# EAGLE design hihats (EAGLE 6.4)
DATABASE: ../partsdb.txt

## Sheet 1 of 2
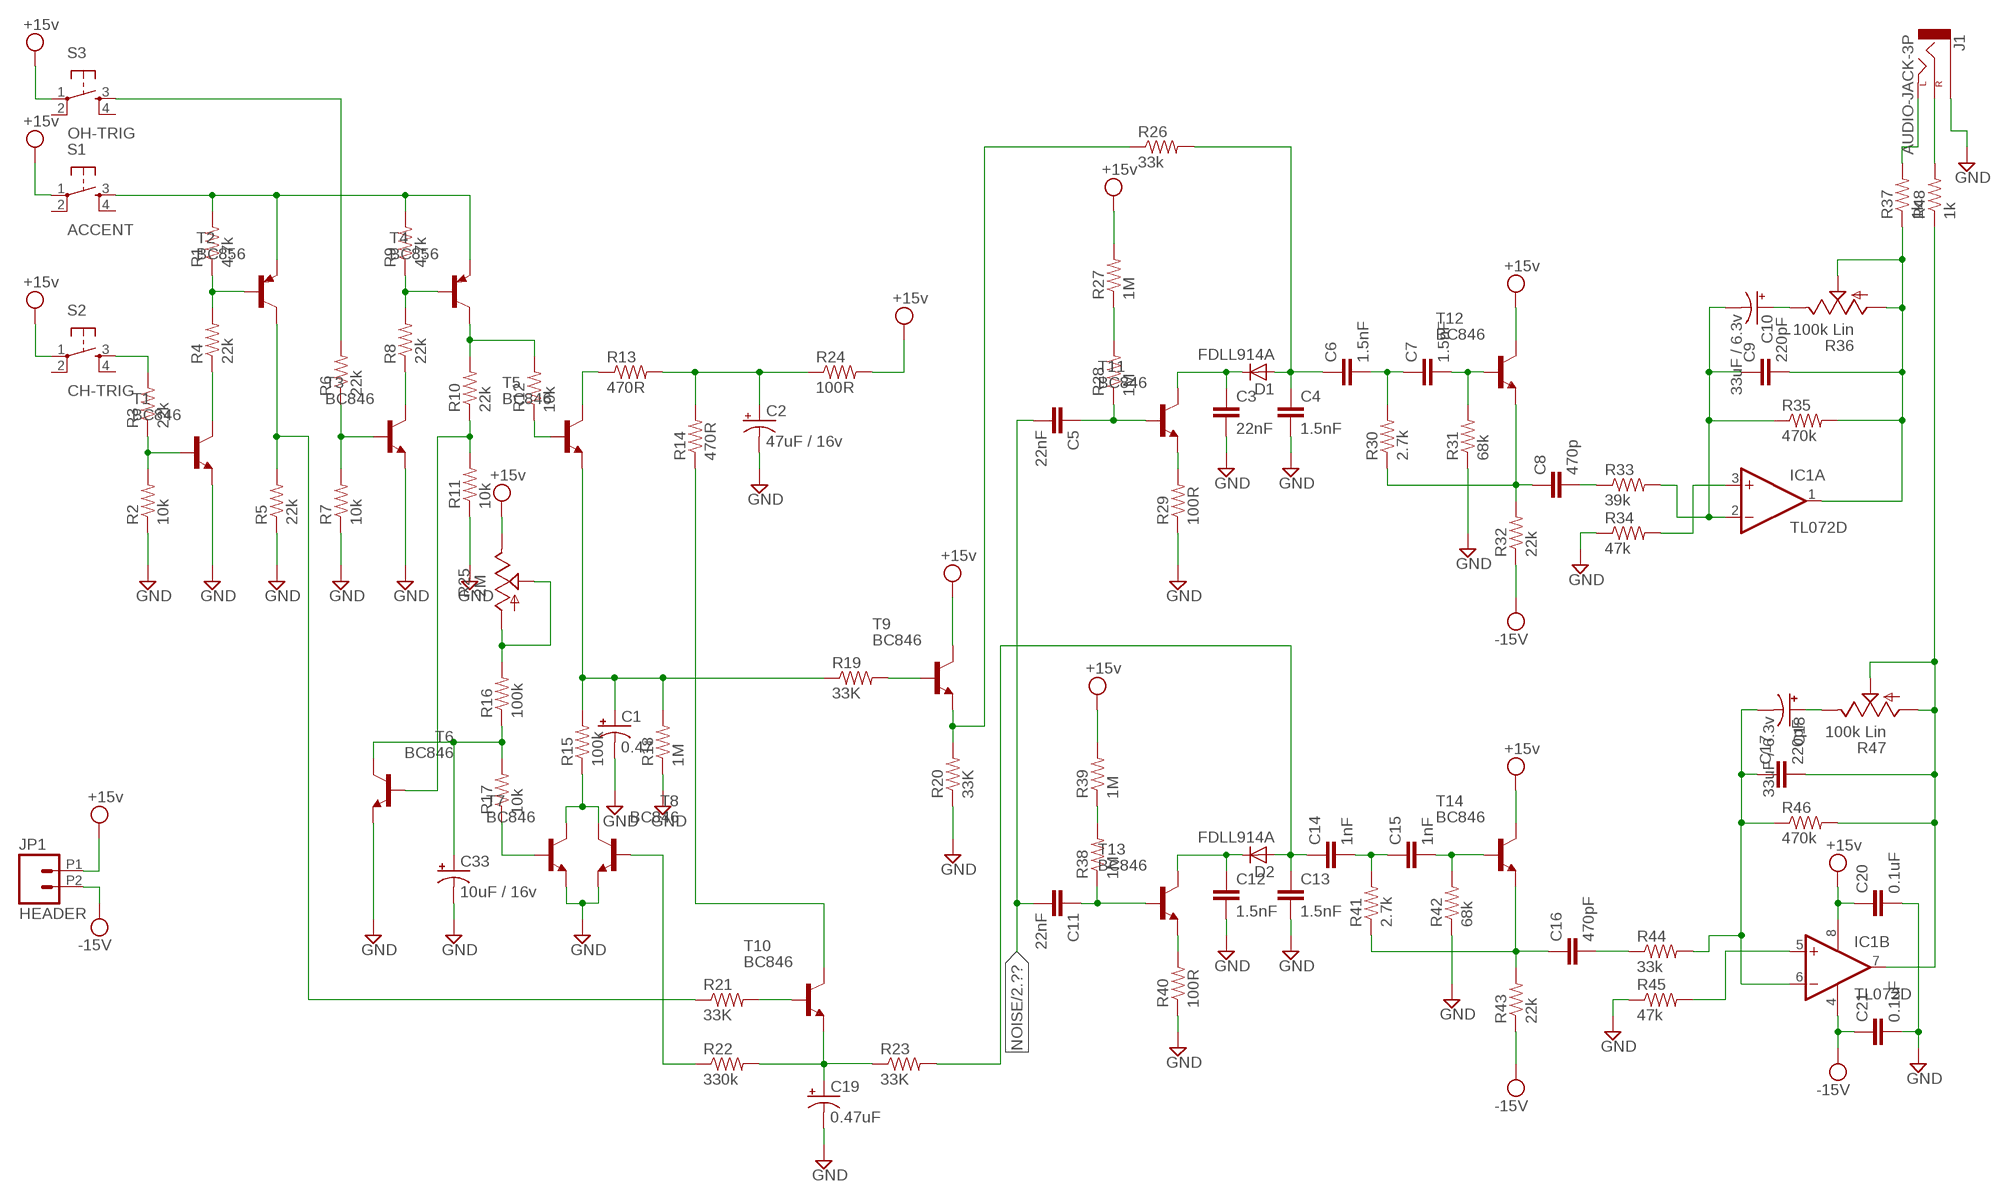
[diagram p0: schematic, sheet 1]

### Parts
C1  0.47  CAP-POLPANASONIC_B-2  [PANASONIC_VS_B-2]
C2  47uF / 16v  CAP-POLPANASONIC_B-2  [PANASONIC_VS_B-2]
C3  22nF  CAP0805  [0805]
C4  1.5nF  CAP0805  [0805]
C5  22nF  CAP0805  [0805]
C6  1.5nF  CAP0805  [0805]
C7  1.5nF  CAP0805  [0805]
C8  470p  CAP0805  [0805]
C9  220pF  CAP0805  [0805]
C10  33uF / 6.3v  CAP-POLPANASONIC_B-2  [PANASONIC_VS_B-2]
C11  22nF  CAP0805  [0805]
C12  1.5nF  CAP0805  [0805]
C13  1.5nF  CAP0805  [0805]
C14  1nF  CAP0805  [0805]
C15  1nF  CAP0805  [0805]
C16  470pF  CAP0805  [0805]
C17  220pF  CAP0805  [0805]
C18  33uF / 6.3v  CAP-POLPANASONIC_B-2  [PANASONIC_VS_B-2]
C19  0.47uF  CAP-POLPANASONIC_B-2  [PANASONIC_VS_B-2]
C20  0.1uF  CAP0805  [0805]
C21  0.1uF  CAP0805  [0805]
C33  10uF / 16v  CAP-POLPANASONIC_B-2  [PANASONIC_VS_B-2]
D1  FDLL914A  D-MLL-34  [MELF-MLL34]
D2  FDLL914A  D-MLL-34  [MELF-MLL34]
IC1  TL072D  [SO08]
J1  AUDIO-JACK-3P  [CUI-352X-SMT]
JP1  HEADER  [1X02-5.08-SCREWTERM]
R1  4.7k  RESISTOR0805-RES  [0805]
R2  10k  RESISTOR0805-RES  [0805]
R3  22k  RESISTOR0805-RES  [0805]
R4  22k  RESISTOR0805-RES  [0805]
R5  22k  RESISTOR0805-RES  [0805]
R6  22k  RESISTOR0805-RES  [0805]
R7  10k  RESISTOR0805-RES  [0805]
R8  22k  RESISTOR0805-RES  [0805]
R9  4.7k  RESISTOR0805-RES  [0805]
R10  22k  RESISTOR0805-RES  [0805]
R11  10k  RESISTOR0805-RES  [0805]
R12  10k  RESISTOR0805-RES  [0805]
R13  470R  RESISTOR0805-RES  [0805]
R14  470R  RESISTOR0805-RES  [0805]
R15  100k  RESISTOR0805-RES  [0805]
R16  100k  RESISTOR0805-RES  [0805]
R17  10k  RESISTOR0805-RES  [0805]
R18  1M  RESISTOR0805-RES  [0805]
R19  33K  RESISTOR0805-RES  [0805]
R20  33K  RESISTOR0805-RES  [0805]
R21  33K  RESISTOR0805-RES  [0805]
R22  330k  RESISTOR0805-RES  [0805]
R23  33K  RESISTOR0805-RES  [0805]
R24  100R  RESISTOR0805-RES  [0805]
R25  2M  POTTHUMB-3352  [POTENTIOMETER-3352P]
R26  33k  RESISTOR0805-RES  [0805]
R27  1M  RESISTOR0805-RES  [0805]
R28  1M  RESISTOR0805-RES  [0805]
R29  100R  RESISTOR0805-RES  [0805]
R30  2.7k  RESISTOR0805-RES  [0805]
R31  68k  RESISTOR0805-RES  [0805]
R32  22k  RESISTOR0805-RES  [0805]
R33  39k  RESISTOR0805-RES  [0805]
R34  47k  RESISTOR0805-RES  [0805]
R35  470k  RESISTOR0805-RES  [0805]
R36  100k Lin  POTCTS296  [POTENTIOMETER-CTS296]
R37  1k  RESISTOR0805-RES  [0805]
R38  1M  RESISTOR0805-RES  [0805]
R39  1M  RESISTOR0805-RES  [0805]
R40  100R  RESISTOR0805-RES  [0805]
R41  2.7k  RESISTOR0805-RES  [0805]
R42  68k  RESISTOR0805-RES  [0805]
R43  22k  RESISTOR0805-RES  [0805]
R44  33k  RESISTOR0805-RES  [0805]
R45  47k  RESISTOR0805-RES  [0805]
R46  470k  RESISTOR0805-RES  [0805]
R47  100k Lin  POTCTS296  [POTENTIOMETER-CTS296]
R48  1k  RESISTOR0805-RES  [0805]
S1  ACCENT  TAC_SWITCHSMD  [TACTILE_SWITCH_SMD]
S2  CH-TRIG  TAC_SWITCHSMD  [TACTILE_SWITCH_SMD]
S3  OH-TRIG  TAC_SWITCHSMD  [TACTILE_SWITCH_SMD]
T1  BC846  [SOT23]
T2  BC856  BC856B-PNP-SOT23-BEC  [SOT23-BEC]
T3  BC846  [SOT23]
T4  BC856  BC856B-PNP-SOT23-BEC  [SOT23-BEC]
T5  BC846  [SOT23]
T6  BC846  [SOT23]
T7  BC846  [SOT23]
T8  BC846  [SOT23]
T9  BC846  [SOT23]
T10  BC846  [SOT23]
T11  BC846  [SOT23]
T12  BC846  [SOT23]
T13  BC846  [SOT23]
T14  BC846  [SOT23]

### Nets
+15V: C20.1 IC1.8(P:V+) JP1.P1 R24.2 R25.P$3(E) R27.2 R39.2 S1.1 S2.1 S3.1 T9.3(C) T12.3(C) T14.3(C) ; supply symbol labelled +15v ; also sheet 2
-15V: C21.1 IC1.4(P:V-) JP1.P2 R32.1 R43.1 ; also sheet 2
GND: C1.- C2.- C3.2 C4.2 C12.2 C13.2 C19.- C20.2 C21.2 C33.- J1.1(SLEEVE) R2.1 R5.1 R7.1 R11.1 R18.1 R20.1 R29.1 R31.1 R34.1 R40.1 R42.1 R45.1 T1.2(E) T3.2(E) T6.2(E) T7.2(E) T8.2(E) ; also sheet 2
N$1: R1.2 R9.2 S1.3 T2.E T4.E
N$2: R1.1 R4.2 T2.B
N$3: R3.2 S2.3
N$4: R2.2 R3.1 T1.1(B)
N$5: R4.1 T1.3(C)
N$6: R8.2 R9.1 T4.B
N$7: R5.2 R21.1 T2.C
N$8: R6.2 S3.3
N$9: R6.1 R7.2 T3.1(B)
N$10: R8.1 T3.3(C)
N$11: R10.2 R12.2 T4.C
N$12: R10.1 R11.2 T6.1(B)
N$13: R12.1 T5.1(B)
N$14: R13.1 T5.3(C)
N$15: C2.+ R13.2 R14.2 R24.1
N$16: R15.1 T7.3(C) T8.3(C)
N$17: C33.+ R16.1 R17.2 T6.3(C)
N$18: R19.2 T9.1(B)
N$19: R17.1 T7.1(B)
N$20: R20.2 R26.1 T9.2(E)
N$21: R21.2 T10.1(B)
N$22: C1.+ R15.2 R18.2 R19.1 T5.2(E)
N$23: R22.1 T8.1(B)
N$24: C19.+ R22.2 R23.1 T10.2(E)
N$25: R14.1 T10.3(C)
N$26: C4.1 C6.1 D1.2(A) R26.2
N$27: R16.2 R25.P$1(A) R25.P$2(S)
N$28: R27.1 R28.2
N$29: C5.1 R28.1 T11.1(B)
N$31: R29.2 T11.2(E)
N$32: C3.1 D1.1(C) T11.3(C)
N$33: C6.2 C7.1 R30.2
N$34: C7.2 R31.2 T12.1(B)
N$35: C8.1 R30.1 R32.2 T12.2(E)
N$36: C8.2 R33.1
N$37: C9.1 C10.- IC1.2(A:-IN) R33.2 R35.1
N$38: IC1.3(A:+IN) R34.2
N$39: C9.2 IC1.1(A:OUT) R35.2 R36.P$1(A) R36.P$2(S) R37.1
N$40: R40.2 T13.2(E)
N$41: C10.+ R36.P$3(E)
N$42: C12.1 D2.1(C) T13.3(C)
N$43: R38.2 R39.1
N$44: C11.1 R38.1 T13.1(B)
N$45: C13.1 C14.1 D2.2(A) R23.2
N$46: C14.2 C15.1 R41.2
N$47: C15.2 R42.2 T14.1(B)
N$48: C16.1 R41.1 R43.2 T14.2(E)
N$49: C16.2 R44.1
N$50: C17.1 C18.- IC1.6(B:-IN) R44.2 R46.1
N$51: IC1.5(B:+IN) R45.2
N$52: J1.2(LEFT) R37.2
N$53: C17.2 IC1.7(B:OUT) R46.2 R47.P$1(A) R47.P$2(S) R48.1
N$54: C18.+ R47.P$3(E)
N$55: J1.3(RIGHT) R48.2
NOISE: C5.2 C11.2 ; also sheet 2
Unconnected: S1.2 S1.4 S2.2 S2.4 S3.2 S3.4

## Sheet 2 of 2
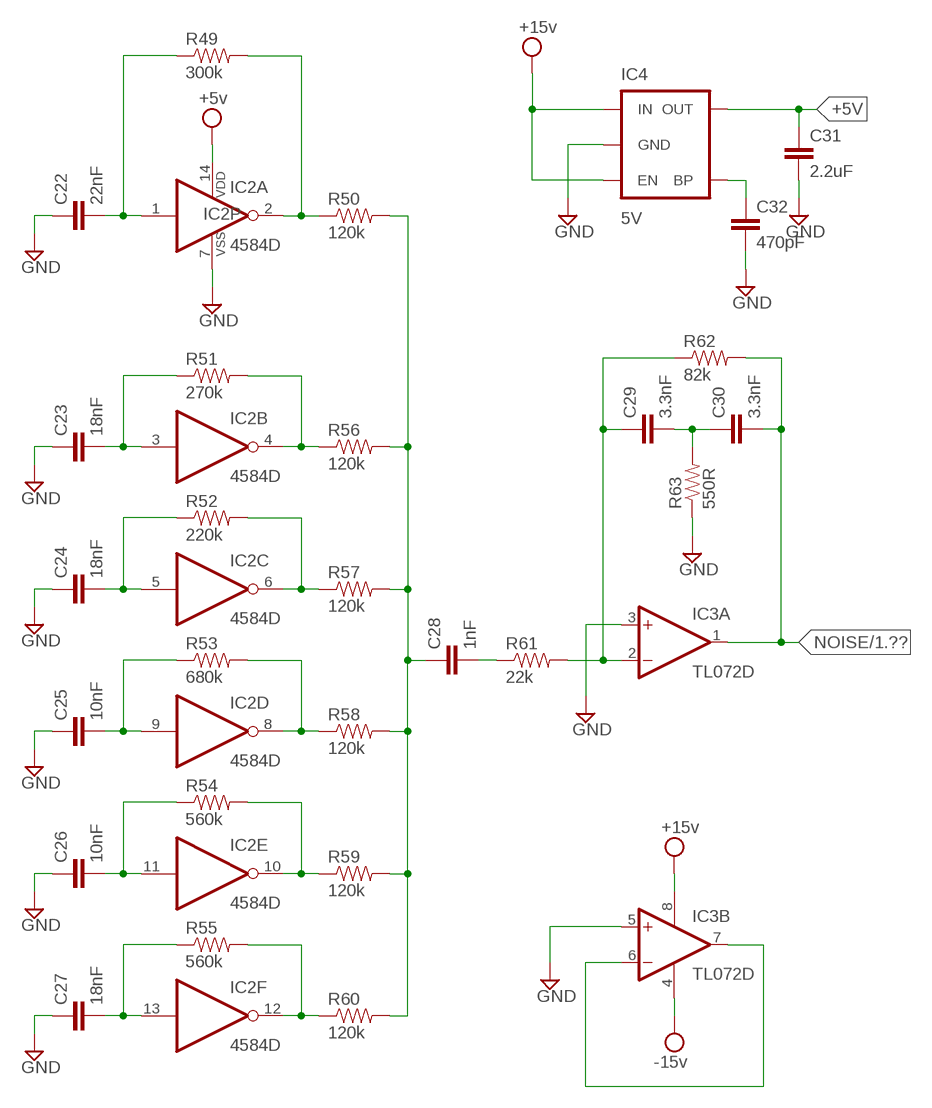
[diagram p1: schematic, sheet 2]

### Parts
C22  22nF  CAP0805  [0805]
C23  18nF  CAP0805  [0805]
C24  18nF  CAP0805  [0805]
C25  10nF  CAP0805  [0805]
C26  10nF  CAP0805  [0805]
C27  18nF  CAP0805  [0805]
C28  1nF  CAP0805  [0805]
C29  3.3nF  CAP0805  [0805]
C30  3.3nF  CAP0805  [0805]
C31  2.2uF  CAP0805  [0805]
C32  470pF  CAP0805  [0805]
IC2  4584D  [SO14]
IC3  TL072D  [SO08]
IC4  5V  V_REG_MIC52055V  [SOT23-5]
R49  300k  RESISTOR0805-RES  [0805]
R50  120k  RESISTOR0805-RES  [0805]
R51  270k  RESISTOR0805-RES  [0805]
R52  220k  RESISTOR0805-RES  [0805]
R53  680k  RESISTOR0805-RES  [0805]
R54  560k  RESISTOR0805-RES  [0805]
R55  560k  RESISTOR0805-RES  [0805]
R56  120k  RESISTOR0805-RES  [0805]
R57  120k  RESISTOR0805-RES  [0805]
R58  120k  RESISTOR0805-RES  [0805]
R59  120k  RESISTOR0805-RES  [0805]
R60  120k  RESISTOR0805-RES  [0805]
R61  22k  RESISTOR0805-RES  [0805]
R62  82k  RESISTOR0805-RES  [0805]
R63  550R  RESISTOR0805-RES  [0805]

### Nets
+5V: C31.1 IC2.14(P:VDD) IC4.5(OUT) ; supply symbol labelled +5v
+15V: IC3.8(P:V+) IC4.1(IN) IC4.3(EN) ; supply symbol labelled +15v ; also sheet 1
-15V: IC3.4(P:V-) ; supply symbol labelled -15v ; also sheet 1
GND: C22.1 C23.1 C24.1 C25.1 C26.1 C27.1 C31.2 C32.2 IC2.7(P:VSS) IC3.3(A:+IN) IC3.5(B:+IN) IC4.2(GND) R63.1 ; also sheet 1
N$56: IC2.2(A:O) R49.2 R50.1
N$57: C22.2 IC2.1(A:I) R49.1
N$58: C27.2 IC2.13(F:I) R55.1
N$59: C26.2 IC2.11(E:I) R54.1
N$60: C25.2 IC2.9(D:I) R53.1
N$61: C24.2 IC2.5(C:I) R52.1
N$62: C23.2 IC2.3(B:I) R51.1
N$63: IC2.4(B:O) R51.2 R56.1
N$64: IC2.6(C:O) R52.2 R57.1
N$65: IC2.8(D:O) R53.2 R58.1
N$66: IC2.10(E:O) R54.2 R59.1
N$67: IC2.12(F:O) R55.2 R60.1
N$68: C28.1 R50.2 R56.2 R57.2 R58.2 R59.2 R60.2
N$69: IC3.6(B:-IN) IC3.7(B:OUT)
N$70: C28.2 R61.1
N$71: C29.1 IC3.2(A:-IN) R61.2 R62.1
N$72: C29.2 C30.1 R63.2
N$74: C32.1 IC4.4(BP)
NOISE: C30.2 IC3.1(A:OUT) R62.2 ; also sheet 1

## Library data of the parts
C1 = Livestream:CAP-POL; PARTNO: EEE-1HAR47AR
C2 = Livestream:CAP-POL; PARTNO: EEE-1CA470WR
C3-C9 C11-C17 C20-C32 = SparkFun-Capacitors:CAP: Capacitor Standard 0603 ceramic capacitor, and 0.1" leaded capacitor.; PARTNO: C0805C682K5RACTU
C10 C18 = Livestream:CAP-POL; PARTNO: EEE-1AA330WAR
C19 = Livestream:CAP-POL; PARTNO: UWJ1HR47MCL1GB
C33 = Livestream:CAP-POL; PARTNO: EEE-1VA100WAR
D1 D2 = semicon-smd-ipc:D-: DIODE unfilled; PARTNO: FDLL914A
IC1 IC3 = linear:TL072: OP AMP; PARTNO: TL072SG-13
IC2 = 45xx:4584: Hex SCHMITT TRIGGER (74C14); PARTNO: BU4584BF-E2
IC4 = SparkFun-PowerIC:V_REG_MIC5205: V_REG MIC5219 Standard 3.3V and 5V 150mA LDO voltage regulator in SOT-23 layout. Micrel part MIC5205. BP (by-pass) pin is used to lower output noise with 470pF cap, may be left open.; PARTNO: MIC5205-5.0YM5 TR; PROD_ID: VREG-00823
J1 = Livestream:AUDIO-JACK-3P; PARTNO: SJ-3523-SMT-TR
JP1 = Livestream:HEADER
R1-R24 R26-R35 R37-R46 R48-R63 = SparkFun-Resistors:RESISTOR: Resistor Basic schematic elements and footprints for 0603, 1206, and PTH resistors.; PARTNO: RMCF0805FT10K0
R25 = 808:POT; PARTNO: 3352P-1-205LF
R36 R47 = 808:POT; PARTNO: 296UD104B1N
S1-S3 = SparkFun-Electromechanical:TAC_SWITCH: Momentary Switch Button commonly used for reset or general input. Spark Fun Electronics SKU : COM-00097 SMT- SWCH-08247; PARTNO: PTS525SM10SMTR LFS; PROD_ID: SWCH-08247
T1 T3 T5-T14 = transistor-neu-to92:BC846: NPN TRANSISTOR; PARTNO: BC846BMTF
T2 T4 = transistor-neu-to92:*-PNP-: PNP Transistror; PARTNO: BC856BMTF

## Board
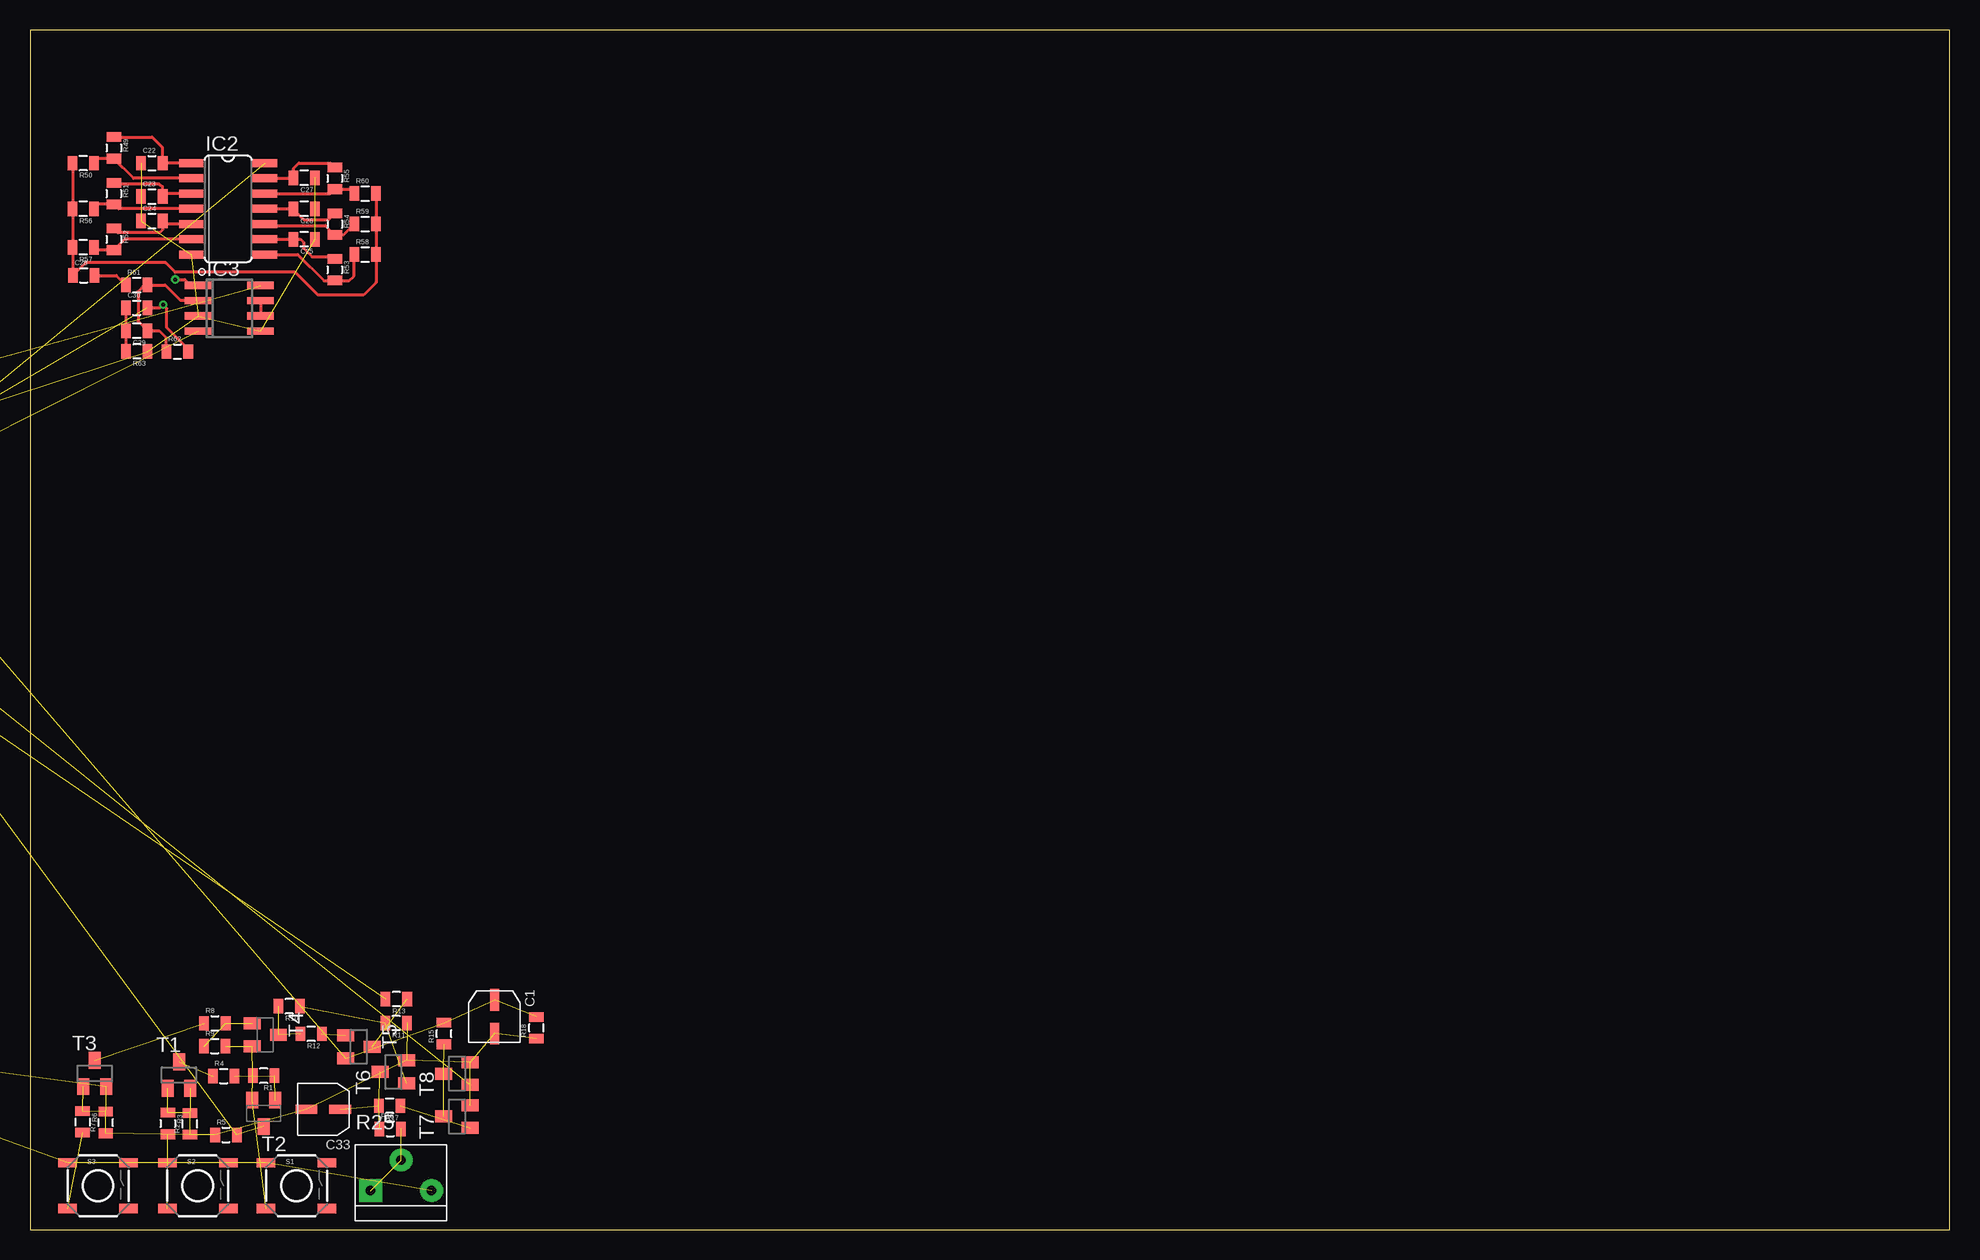
[diagram p2: board, top side]
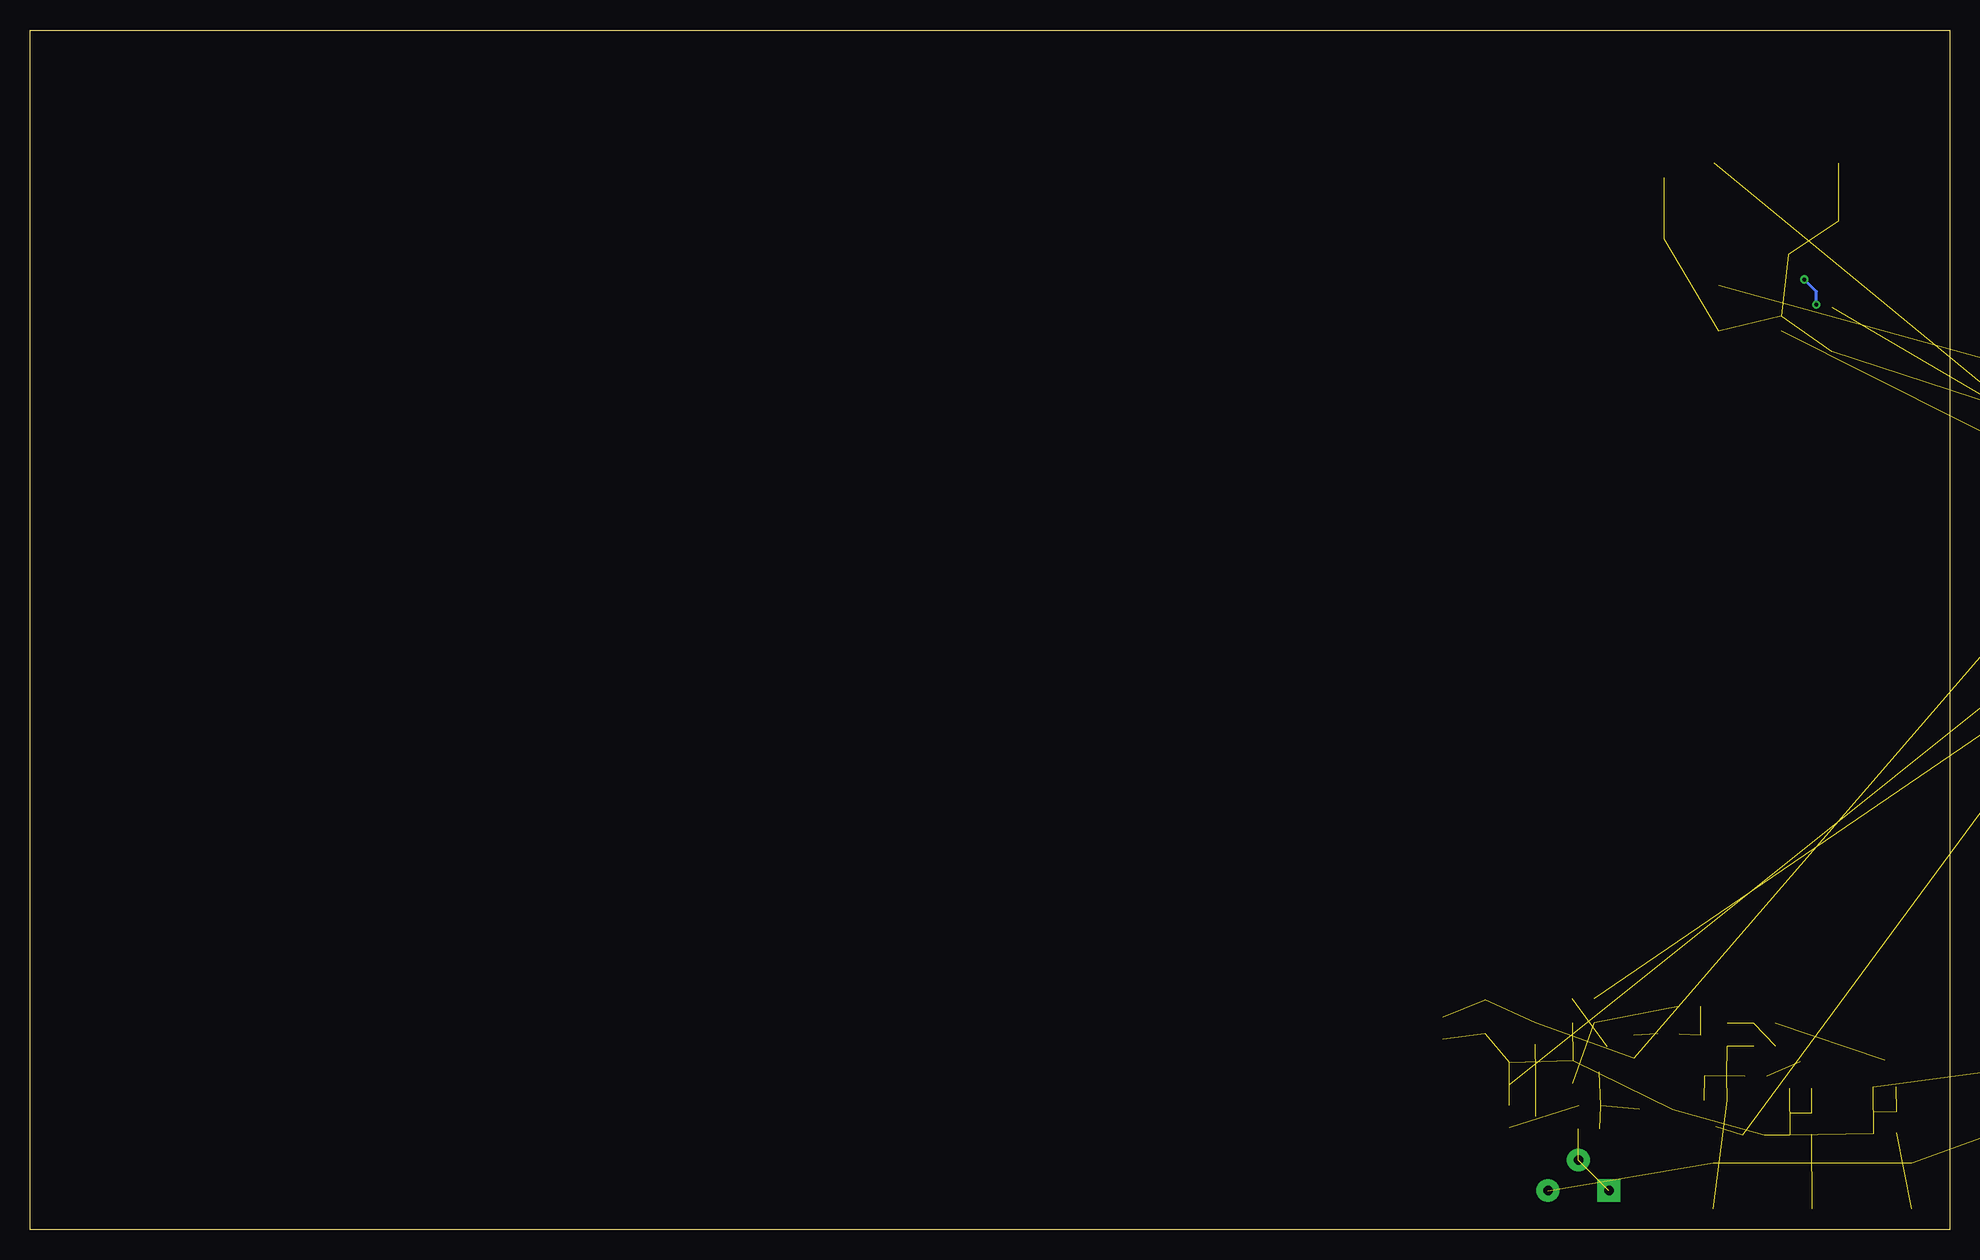
[diagram p3: board, bottom side, seen from below]

Size 160 x 100 mm. Coordinates in mm from the lower left corner, seen from the top.
Outline: 0,0 160,0 160,100 0,100 0,0
Copper layers (1*16): Top 0.0356mm / dielectric 1.5011mm / Bottom 0.0356mm
Design rules "OSHPark": minimum track width 6mil, minimum drill 13mil, track to track 6mil, track to pad 6mil, pad to pad 6mil, via to via 6mil, smd to smd 6mil, copper to edge 15mil, drill to drill 6mil, minimum pad ring 7mil, minimum via ring 7mil, stop-mask expansion 3mil, vias tented up to drill 0mil, thermal gap 10mil

### Footprints (pad centres in the part's own frame; a part is rotated, then mirrored left to right if it is on the bottom)
PANASONIC_VS_B-2 = smd 0.75 x 1.8: + 0,-1.4; - 0,1.4
0805 = smd 0.8 x 1.2: 1 -0.9,0; 2 0.9,0
MELF-MLL34 = smd 1.4 x 1.8: 1 -1.7,0; 2 1.7,0
SO08 = smd 0.6 x 2.2: 1 -1.905,-2.6; 2 -0.635,-2.6; 3 0.635,-2.6; 4 1.905,-2.6; 5 1.905,2.6; 6 0.635,2.6; 7 -0.635,2.6; 8 -1.905,2.6
SO14 = smd 0.66 x 2.032: 1 -3.81,-3.073; 2 -2.54,-3.073; 3 -1.27,-3.073; 4 0,-3.073; 5 1.27,-3.073; 6 2.54,-3.073; 7 3.81,-3.073; 8 3.81,3.073; 9 2.54,3.073; 10 1.27,3.073; 11 0,3.073; 12 -1.27,3.073; 13 -2.54,3.073; 14 -3.81,3.073
SOT23-5 = smd 0.55 x 1.2: 1 -0.95,-1.3; 2 0,-1.3; 3 0.95,-1.3; 4 0.95,1.3; 5 -0.95,1.3
CUI-352X-SMT = smd 2.2 x 2.8: 1 -4.6,-3.7 | smd 2.8 x 2.8: 2 4.8,-3.7; 4 8.7,0.75 | smd 2.2 x 2.5: 3 -2.6,3.2 | hole 1.7: -3.5,0; 3.5,0
1X02-5.08-SCREWTERM = drill 1.016 square: P1 -2.54,0; P2 2.54,0
POTENTIOMETER-3352P = drill 0.8 pad 1.905 square: P$1 0,0 | drill 0.8 pad 1.905: P$2 2.54,2.54; P$3 5.08,0
POTENTIOMETER-CTS296 = drill 1.3 pad 2.5 square: P$1 -3.75,-5 | drill 1.3 pad 2.5: P$2 0,-5; P$3 3.75,-5 | hole 1.6: -5.5,5; 5.5,5
TACTILE_SWITCH_SMD = smd 1.524 x 0.762: 1 -2.54,1.905; 2 2.54,1.905; 3 -2.54,-1.905; 4 2.54,-1.905
SOT23 = smd 1 x 1.4: 1 -0.95,-1.1; 2 0.95,-1.1; 3 0,1.1
SOT23-BEC = smd 1 x 1.4: B -0.95,-1.1; C 0,1.1; E 0.95,-1.1

### Placement (x,y rotation side)
C1  38.72,17.75 180 top
C2  -73.66,36.83 0 top  (outside the outline)
C3  -27.94,50.8 0 top  (outside the outline)
C4  -31.75,50.8 0 top  (outside the outline)
C5  -35.56,50.8 0 top  (outside the outline)
C6  -39.37,50.8 0 top  (outside the outline)
C7  -43.18,50.8 0 top  (outside the outline)
C8  -46.99,50.8 0 top  (outside the outline)
C9  -50.8,50.8 0 top  (outside the outline)
C10  -55.88,36.83 0 top  (outside the outline)
C11  -54.61,50.8 0 top  (outside the outline)
C12  -58.42,50.8 0 top  (outside the outline)
C13  -62.23,50.8 0 top  (outside the outline)
C14  -66.04,50.8 0 top  (outside the outline)
C15  -69.85,50.8 0 top  (outside the outline)
C16  -73.66,50.8 0 top  (outside the outline)
C17  -15.24,55.88 0 top  (outside the outline)
C18  -64.77,36.83 0 top  (outside the outline)
C19  -17.78,50.8 0 top  (outside the outline)
C20  -19.05,55.88 0 top  (outside the outline)
C21  -22.86,55.88 0 top  (outside the outline)
C22  10.16,88.9 0 top
C23  10.16,86.11 0 top
C24  10.16,84.07 0 top
C25  22.86,82.55 180 top
C26  22.86,85.09 180 top
C27  22.86,87.68 180 top
C28  4.48,79.54 0 top
C29  8.89,74.93 180 top
C30  8.89,76.83 0 top
C31  -60.96,55.88 0 top  (outside the outline)
C32  -64.77,55.88 0 top  (outside the outline)
C33  24.45,10.02 90 top
D1  -29.21,44.45 0 top  (outside the outline)
D2  -39.37,44.45 0 top  (outside the outline)
IC1  -39.37,19.05 0 top  (outside the outline)
IC2  16.51,85.09 270 top
IC3  16.61,76.8 270 top
IC4  -24.13,50.8 0 top  (outside the outline)
J1  -24.13,20.32 0 top  (outside the outline)
JP1  -62.23,5.08 0 top  (outside the outline)
R1  19.48,12.82 180 top
R2  13.32,8.81 90 top
R3  11.49,8.84 270 top
R4  16.15,12.79 0 top
R5  16.34,7.89 0 top
R6  4.39,8.97 270 top
R7  6.31,8.92 90 top
R8  15.41,17.19 0 top
R9  15.4,15.29 0 top
R10  21.61,18.61 180 top
R11  30.52,17.21 180 top
R12  23.43,16.31 180 top
R13  30.54,19.21 180 top
R14  -57.15,59.69 0 top  (outside the outline)
R15  34.51,16.34 90 top
R16  30.03,8.39 0 top
R17  29.98,10.31 180 top
R18  42.21,16.81 90 top
R19  -15.24,63.5 0 top  (outside the outline)
R20  -19.05,63.5 0 top  (outside the outline)
R21  -22.86,63.5 0 top  (outside the outline)
R22  -26.67,63.5 0 top  (outside the outline)
R23  -30.48,63.5 0 top  (outside the outline)
R24  -34.29,63.5 0 top  (outside the outline)
R25  28.39,3.25 0 top
R26  -38.1,63.5 0 top  (outside the outline)
R27  -41.91,63.5 0 top  (outside the outline)
R28  -45.72,63.5 0 top  (outside the outline)
R29  -49.53,63.5 0 top  (outside the outline)
R30  -53.34,63.5 0 top  (outside the outline)
R31  -57.15,63.5 0 top  (outside the outline)
R32  -60.96,63.5 0 top  (outside the outline)
R33  -64.77,63.5 0 top  (outside the outline)
R34  -68.58,63.5 0 top  (outside the outline)
R35  -72.39,63.5 0 top  (outside the outline)
R36  -21.59,7.62 0 top  (outside the outline)
R37  -15.24,67.31 0 top  (outside the outline)
R38  -19.05,67.31 0 top  (outside the outline)
R39  -22.86,67.31 0 top  (outside the outline)
R40  -26.67,67.31 0 top  (outside the outline)
R41  -30.48,67.31 0 top  (outside the outline)
R42  -34.29,67.31 0 top  (outside the outline)
R43  -38.1,67.31 0 top  (outside the outline)
R44  -41.91,67.31 0 top  (outside the outline)
R45  -45.72,67.31 0 top  (outside the outline)
R46  -49.53,67.31 0 top  (outside the outline)
R47  -39.37,7.62 0 top  (outside the outline)
R48  -53.34,67.31 0 top  (outside the outline)
R49  6.99,90.17 270 top
R50  4.45,88.9 180 top
R51  6.99,86.36 270 top
R52  6.99,82.55 270 top
R53  25.4,80.01 270 top
R54  25.4,83.82 270 top
R55  25.4,87.63 270 top
R56  4.45,85.09 180 top
R57  4.45,81.88 180 top
R58  27.94,81.28 0 top
R59  27.94,83.82 0 top
R60  27.94,86.36 0 top
R61  8.89,78.74 0 top
R62  12.29,73.19 0 top
R63  8.9,73.2 180 top
S1  22.21,3.65 0 top
S2  13.99,3.65 0 top
S3  5.67,3.65 0 top
T1  12.42,12.88 0 top
T2  19.48,9.69 180 top
T3  5.4,13.01 0 top
T4  19.61,16.22 270 top
T5  27.41,15.24 270 top
T6  30.29,13.14 90 top
T7  35.59,9.42 90 top
T8  35.59,13 90 top
T9  -71.12,29.21 0 top  (outside the outline)
T10  -17.78,36.83 0 top  (outside the outline)
T11  -25.4,36.83 0 top  (outside the outline)
T12  -33.02,36.83 0 top  (outside the outline)
T13  -40.64,36.83 0 top  (outside the outline)
T14  -48.26,36.83 0 top  (outside the outline)

### Tracks (layer width: path | path; a pad name or v marks a point on that pad's centre or on a via)
+5V  (2 unrouted)
+15V  (15 unrouted)
-15V  (5 unrouted)
GND  (40 unrouted)
N$1  (4 unrouted)
N$2  (2 unrouted)
N$3  (1 unrouted)
N$4  (2 unrouted)
N$5  (1 unrouted)
N$6  (2 unrouted)
N$7  (2 unrouted)
N$8  (1 unrouted)
N$9  (2 unrouted)
N$10  (1 unrouted)
N$11  (2 unrouted)
N$12  (2 unrouted)
N$13  (1 unrouted)
N$14  (1 unrouted)
N$15  (3 unrouted)
N$16  (2 unrouted)
N$17  (3 unrouted)
N$18  (1 unrouted)
N$19  (1 unrouted)
N$20  (2 unrouted)
N$21  (1 unrouted)
N$22  (4 unrouted)
N$23  (1 unrouted)
N$24  (3 unrouted)
N$25  (1 unrouted)
N$26  (3 unrouted)
N$27  (2 unrouted)
N$28  (1 unrouted)
N$29  (2 unrouted)
N$31  (1 unrouted)
N$32  (2 unrouted)
N$33  (2 unrouted)
N$34  (2 unrouted)
N$35  (3 unrouted)
N$36  (1 unrouted)
N$37  (4 unrouted)
N$38  (1 unrouted)
N$39  (5 unrouted)
N$40  (1 unrouted)
N$41  (1 unrouted)
N$42  (2 unrouted)
N$43  (1 unrouted)
N$44  (2 unrouted)
N$45  (3 unrouted)
N$46  (2 unrouted)
N$47  (2 unrouted)
N$48  (3 unrouted)
N$49  (1 unrouted)
N$50  (4 unrouted)
N$51  (1 unrouted)
N$52  (1 unrouted)
N$53  (5 unrouted)
N$54  (1 unrouted)
N$55  (1 unrouted)
N$56
  Top 0.254: R50.1 5.71,89.27 R49.2 8.62,87.63 IC2.2
N$57
  Top 0.254: IC2.1 C22.2 11,88.96 11,90.25 10.18,91.07 R49.1
N$58
  Top 0.254: IC2.13 21.91,87.63 C27.2 21.96,88.46 22.4,88.9 25.03,88.9 R55.1
N$59
  Top 0.254: IC2.11 C26.2 21.96,85.04 22.8,84.2 24.88,84.2 R54.1
N$60
  Top 0.254: IC2.9 C25.2 22.55,82.55 22.8,82.3 22.8,81.8 23.5,81.1 25.21,81.1 R53.1
N$61
  Top 0.254: IC2.5 11.31,83.82 C24.2 11.06,83.36 10.8,83.1 7.33,83.1 R52.1
N$62
  Top 0.254: IC2.3 11.31,86.36 C23.2 11.06,86.94 10.75,87.15 7,87.15 R51.1
N$63
  Top 0.254: IC2.4 7.36,85.09 R51.2 5.71,85.46 R56.1
N$64
  Top 0.254: IC2.6 7.88,82.55 R52.2 5.58,81.65 R57.1
N$65
  Top 0.254: IC2.8 22.32,81.28 24.5,79.1 R53.2 26.61,79.11 27,79.5 27,81.24 R58.1
N$66
  Top 0.254: IC2.10 20.28,83.82 20.4,83.7 24.62,83.7 R54.2 26.14,82.92 R59.1
N$67
  Top 0.254: IC2.12 25.03,86.36 R55.2 26.67,86.73 R60.1
N$68
  Top 0.254: R60.2 R59.2 R58.2 28.84,78.94 27.8,77.9 24,77.9 22.1,79.8 12.1,79.8 11.3,80.6 4.64,80.6 C28.1 3.54,79.58 R57.2 R56.2 R50.2
N$69
  Top 0.254: IC3.7 IC3.6
N$70
  Top 0.254: C28.2 7.19,79.54 R61.1
N$71
  Top 0.254: IC3.2 13.95,77.5 12.5,77.5 11.26,78.74 R61.2 9.54,78.74 9,78.2 9,75.72 C29.1 10.77,74.93 11.3,74.4 11.3,73.28 R62.1
N$72
  Top 0.254: C30.1 C29.2 7.99,73.22 R63.2
N$74  (1 unrouted)
NOISE  (via drill 0.33)  (2 unrouted)
  Top 0.254: C30.2 10.84,76.83 v11.1,77.1 11.4,76.8 11.4,75.2 13.19,73.41 R62.2 | v12.1,79.2 12.9,79.2 13.3,78.8 13.91,78.8 IC3.1
  Bottom 0.254: v11.1,77.1 11.1,78.2 v12.1,79.2